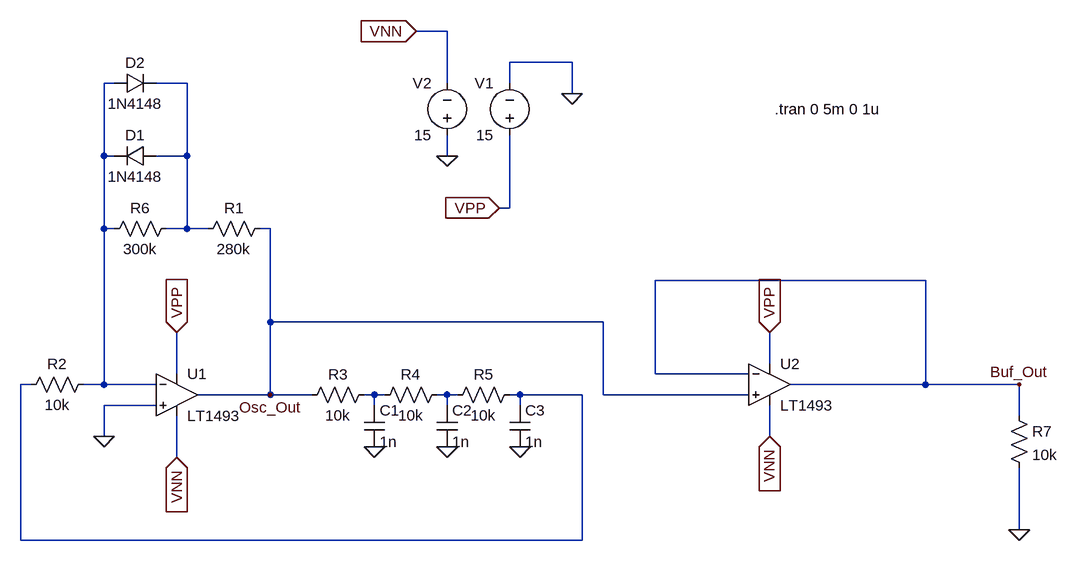
[diagram p0: schematic SineWave_Waveform_GeneratorUpdate.asc]
SineWave_Waveform_GeneratorUpdate.asc, the LTspice schematic file:
Version 4.1
SHEET 1 1828 680
WIRE 880 -400 832 -400
WIRE 1072 -352 976 -352
WIRE 368 -320 352 -320
WIRE 480 -320 432 -320
WIRE 880 -320 880 -400
WIRE 976 -320 976 -352
WIRE 1072 -304 1072 -352
WIRE 352 -208 352 -320
WIRE 368 -208 352 -208
WIRE 480 -208 480 -320
WIRE 480 -208 432 -208
WIRE 880 -208 880 -240
WIRE 976 -128 976 -240
WIRE 976 -128 960 -128
WIRE 352 -96 352 -208
WIRE 368 -96 352 -96
WIRE 480 -96 480 -208
WIRE 480 -96 448 -96
WIRE 512 -96 480 -96
WIRE 608 -96 592 -96
WIRE 1616 -16 1200 -16
WIRE 608 48 608 -96
WIRE 1120 48 608 48
WIRE 1376 112 1376 64
WIRE 464 128 464 64
WIRE 1200 128 1200 -16
WIRE 1344 128 1200 128
WIRE 240 144 224 144
WIRE 352 144 352 -96
WIRE 352 144 320 144
WIRE 432 144 352 144
WIRE 1616 144 1616 -16
WIRE 1616 144 1408 144
WIRE 1760 144 1616 144
WIRE 608 160 608 48
WIRE 608 160 496 160
WIRE 672 160 608 160
WIRE 768 160 752 160
WIRE 784 160 768 160
WIRE 880 160 864 160
WIRE 896 160 880 160
WIRE 992 160 976 160
WIRE 1088 160 992 160
WIRE 1120 160 1120 48
WIRE 1344 160 1120 160
WIRE 432 176 352 176
WIRE 768 176 768 160
WIRE 880 176 880 160
WIRE 992 176 992 160
WIRE 1760 192 1760 144
WIRE 352 224 352 176
WIRE 1376 224 1376 176
WIRE 464 256 464 192
WIRE 1760 368 1760 272
WIRE 224 384 224 144
WIRE 1088 384 1088 160
WIRE 1088 384 224 384
FLAG 768 240 0
FLAG 880 240 0
FLAG 992 240 0
FLAG 1072 -304 0
FLAG 880 -208 0
FLAG 960 -128 VPP
IOPIN 960 -128 In
FLAG 832 -400 VNN
IOPIN 832 -400 In
FLAG 464 64 VPP
IOPIN 464 64 In
FLAG 464 256 VNN
IOPIN 464 256 In
FLAG 1760 368 0
FLAG 1376 64 VPP
IOPIN 1376 64 In
FLAG 1376 224 VNN
IOPIN 1376 224 In
FLAG 608 160 Osc_Out
FLAG 1760 144 Buf_Out
FLAG 352 224 0
SYMBOL OpAmps\\LT1493 464 96 R0
SYMATTR InstName U1
SYMBOL res 608 -112 R90
WINDOW 0 0 56 VBottom 2
WINDOW 3 32 56 VTop 2
SYMATTR InstName R1
SYMATTR Value 280k
SYMBOL res 336 128 R90
WINDOW 0 0 56 VBottom 2
WINDOW 3 32 56 VTop 2
SYMATTR InstName R2
SYMATTR Value 10k
SYMBOL res 768 144 R90
WINDOW 0 0 56 VBottom 2
WINDOW 3 32 56 VTop 2
SYMATTR InstName R3
SYMATTR Value 10k
SYMBOL res 880 144 R90
WINDOW 0 0 56 VBottom 2
WINDOW 3 32 56 VTop 2
SYMATTR InstName R4
SYMATTR Value 10k
SYMBOL res 992 144 R90
WINDOW 0 0 56 VBottom 2
WINDOW 3 32 56 VTop 2
SYMATTR InstName R5
SYMATTR Value 10k
SYMBOL cap 752 176 R0
SYMATTR InstName C1
SYMATTR Value 1n
SYMBOL cap 864 176 R0
SYMATTR InstName C2
SYMATTR Value 1n
SYMBOL cap 976 176 R0
SYMATTR InstName C3
SYMATTR Value 1n
SYMBOL voltage 976 -224 R180
WINDOW 0 24 96 Left 2
WINDOW 3 24 16 Left 2
SYMATTR InstName V1
SYMATTR Value 15
SYMBOL voltage 880 -224 R180
WINDOW 0 24 96 Left 2
WINDOW 3 24 16 Left 2
SYMATTR InstName V2
SYMATTR Value 15
SYMBOL res 464 -112 R90
WINDOW 0 0 56 VBottom 2
WINDOW 3 32 56 VTop 2
SYMATTR InstName R6
SYMATTR Value 300k
SYMBOL diode 432 -224 R90
WINDOW 0 0 32 VBottom 2
WINDOW 3 32 32 VTop 2
SYMATTR InstName D1
SYMATTR Value 1N4148
SYMBOL diode 368 -304 R270
WINDOW 0 32 32 VTop 2
WINDOW 3 0 32 VBottom 2
SYMATTR InstName D2
SYMATTR Value 1N4148
SYMBOL OpAmps\\LT1493 1376 80 R0
SYMATTR InstName U2
SYMBOL res 1744 176 R0
SYMATTR InstName R7
SYMATTR Value 10k
TEXT 1384 -280 Left 2 !.tran 0 5m 0 1u

The netlist it stands for:
* SineWave_Waveform_GeneratorUpdate.asc
X§U1 0 N001 VPP VNN Osc_Out LT1493  ; pins In+ In- V+ V- OUT
R1 Osc_Out N002 280k
R2 N001 N003 10k
R3 N004 Osc_Out 10k
R4 N005 N004 10k
R5 N003 N005 10k
C1 N004 0 1n
C2 N005 0 1n
C3 N003 0 1n
V1 VPP 0 15
V2 0 VNN 15
R6 N002 N001 300k
D1 N002 N001 1N4148
D2 N001 N002 1N4148
X§U2 Osc_Out Buf_Out VPP VNN Buf_Out LT1493  ; pins In+ In- V+ V- OUT
R7 Buf_Out 0 10k
.model D D
.lib standard.dio
.tran 0 5m 0 1u
.backanno
.end